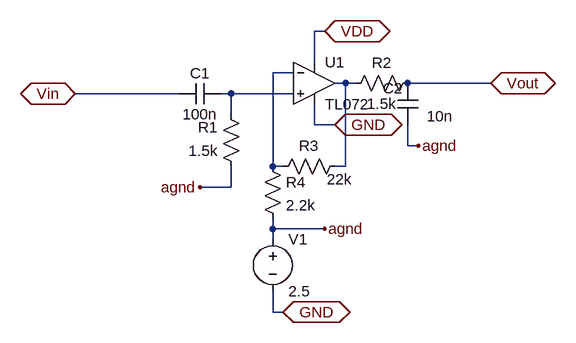
[diagram p0: schematic filtre_pass_band2.asc]
filtre_pass_band2.asc, the LTspice schematic file:
Version 4
SHEET 1 880 680
WIRE 272 112 256 112
WIRE 256 160 256 112
WIRE 224 176 192 176
WIRE 304 192 288 192
WIRE 320 192 304 192
WIRE 528 192 400 192
WIRE 48 208 -112 208
WIRE 128 208 112 208
WIRE 224 208 128 208
WIRE 128 240 128 208
WIRE 256 256 256 224
WIRE 288 256 256 256
WIRE 400 288 400 256
WIRE 416 288 400 288
WIRE 192 320 192 176
WIRE 208 320 192 320
WIRE 304 320 304 192
WIRE 304 320 288 320
WIRE 128 352 128 320
WIRE 128 352 80 352
WIRE 192 416 192 400
WIRE 272 416 192 416
WIRE 192 432 192 416
WIRE 192 544 192 512
WIRE 208 544 192 544
FLAG 272 416 agnd
FLAG 80 352 agnd
FLAG 416 288 agnd
FLAG 208 544 GND
IOPIN 208 544 BiDir
FLAG 528 192 Vout
IOPIN 528 192 BiDir
FLAG 288 256 GND
IOPIN 288 256 BiDir
FLAG 272 112 VDD
IOPIN 272 112 BiDir
FLAG -112 208 Vin
IOPIN -112 208 BiDir
SYMBOL res 144 336 R180
WINDOW 0 36 76 Left 2
WINDOW 3 36 40 Left 2
SYMATTR InstName R1
SYMATTR Value 1.5k
SYMBOL res 416 176 R90
WINDOW 0 0 56 VBottom 2
WINDOW 3 32 56 VTop 2
SYMATTR InstName R2
SYMATTR Value 1.5k
SYMBOL cap 112 192 R90
WINDOW 0 0 32 VBottom 2
WINDOW 3 32 32 VTop 2
SYMATTR InstName C1
SYMATTR Value 100n
SYMBOL cap 416 256 R180
WINDOW 0 24 56 Left 2
WINDOW 3 -54 13 Left 2
SYMATTR InstName C2
SYMATTR Value 10n
SYMBOL res 176 304 R0
SYMATTR InstName R4
SYMATTR Value 2.2k
SYMBOL TL072 256 128 R0
SYMATTR InstName U1
SYMBOL res 304 304 R90
WINDOW 0 0 56 VBottom 2
WINDOW 3 20 9 VTop 2
SYMATTR InstName R3
SYMATTR Value 22k
SYMBOL voltage 192 416 R0
SYMATTR InstName V1
SYMATTR Value 2.5

The netlist it stands for:
* filtre_pass_band2.asc
R1 agnd N003 1.5k
R2 Vout N002 1.5k
C1 N003 Vin 100n
C2 agnd Vout 10n
R4 N001 agnd 2.2k
* U1: TL072 (symbol TL072 not available, pins judged from their places): In+=N003 In-=N001 V+=VDD V-=GND OUT=N002
R3 N002 N001 22k
V1 agnd GND 2.5
.backanno
.end